# Altium schematic sheet comm.SchDoc
size A4; SheetNumber: 4; SheetTotal: 6
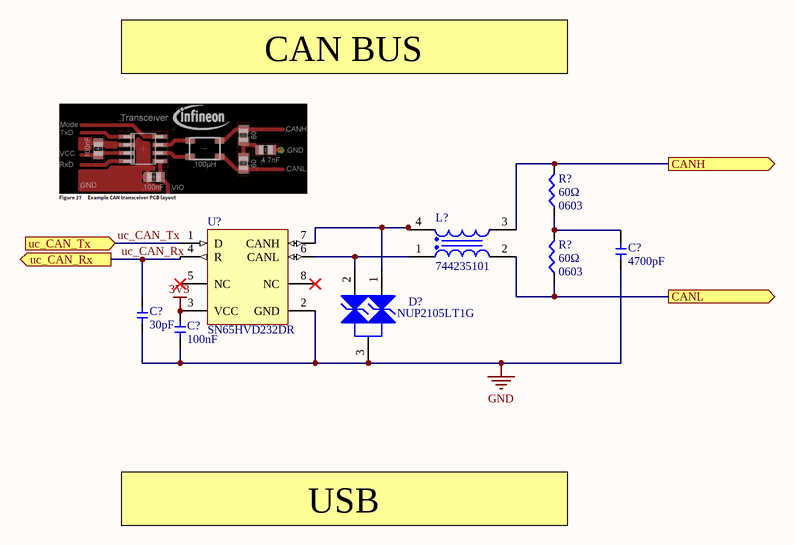
[diagram p0: comm.SchDoc]

## Parts
(Parts that share a designator on the sheet are numbered #1, #2 ... from top to bottom, then left to right.)
C?#1  value 4700pF  [0603_cap]  (hidden comment: 0603_4700pF)
C?#2  value 30pF  [0603_cap]  (hidden comment: 0603_30pF)
C?#3  value 100nF  [0603_cap]  (hidden comment: 0603_100nF)
D?  NUP2105LT1G  [ONSC-SOT-23-3-318-08_V]
L?  744235101  [WE-CNSW_1812]
R?#1  value 60Ω  Package: 0603  [0603-smd]  (hidden comment: 0603_60R)
R?#2  value 60Ω  Package: 0603  [0603-smd]  (hidden comment: 0603_60R)
U?  SN65HVD232DR  [D0008A_M]

## Ports
CANH (out), CANL (out), uc_CAN_Rx (out), uc_CAN_Tx (in)

## Nets
3V3: C?#3.2 U?.3(VCC)
GND: C?#1.1 C?#2.1 C?#3.1 D?.3(K) U?.2(GND)
CANH: L?.3 R?#1.2 ; port CANH
CANL: L?.2 R?#2.1 ; port CANL
uc_CAN_Rx: C?#2.2 U?.4(R) ; port uc_CAN_Rx
uc_CAN_Tx: U?.1(D) ; port uc_CAN_Tx
NetC?#1_2: C?#1.2 R?#1.1 R?#2.2
NetD?_1: D?.1(K) L?.4 U?.7(CANH)
NetD?_2: D?.2(K) L?.1 U?.6(CANL)

Not connected (* = marked no-connect by the designer): U? 5(NC)* 8(NC)*

## Notes on the sheet
- CAN BUS
- USB

## Library data of the parts
C?#1 = 0603_4700pF: Volt: V; Package: 0603
C?#2 = 0603_30pF: Volt: V; Package: 0603
C?#3 = 0603_100nF: Volt: V; Package: 0603
D? = CMP-1063-00164-1: Dual Line CAN Bus Protector, 3-Pin SOT-23, Pb-Free, Tape and Reel; Manufacturer: On Semiconductor; IR Max (uA): 0.1; Number of Lines: 2; Direction: Bidirectional; C Max (pF): 30; PPK Max (W): 350; V(BR) Min (V): 26.2; ComponentLink3URL: http://www.onsemi.cn/pub_link/Collateral/318-08.PDF; Mounting Technology: Surface Mount; ComponentLink2Description: Datasheet; PartNumber: NUP2105LT1G; ComponentLink1URL: http://www.onsemi.com/; PackageVersion: Rev. AP, 11/2009; DatasheetVersion: Rev. 5; RoHS: Pb-Free; PackageReference: SOT-23-3-318-08; ComponentLink2URL: http://www.onsemi.cn/pub_link/Collateral/NUP2105L-D.PDF; ComponentLink1Description: Manufacturer URL; PackageDescription: 3-Pin Small Outline Transistor, Body 2.92 x 1.3 mm, Pitch 0.95 mm; Packing: Tape and Reel; ComponentLink3Description: Package Specification
L? = CMP-207849-000010-2: CMC 100UH 150MA 2LN 8 KOHM SMD; NexarPartId: 61645269; Inductance: 100µH; Number of Lines: 2; DC Resistance (DCR): 2Ω; Voltage Rating (DC): 60V; Test Frequency: 100kHz; Max Current Rating: 150mA; RoHS: Compliant; Packaging: Tape & Reel (TR); Ambient Temperature Range Low: -40°C; Number of Pins: 4; Ambient Temperature Range High: 85°C; Min Operating Temperature: -40°C; Height: 2.8mm; RMS Current (Irms): 150mA; Width: 3.2mm; Current Rating: 150mA; Mount: Surface Mount; Max Operating Temperature: 125°C; Composition: Wirewound; Length: 4.5mm; Series Resistance: 2Ω; Voltage Rating: 60V
R?#1 R?#2 = 0603_60R: Power: W
U? = CMP-0315-00075-2: 3.3 V Can Transceiver, 17 mA, -40 to 85 degC, 8-pin SOIC (D), Green (RoHS & no Sb/Br); Manufacturer: Texas Instruments; Supply Voltage(s)(V): 3.3; Receivers Per Package: 1; ICC(Max)(mA): 17; Rating: Catalog; Transient Pulse Protection(V): -25 to 25; Mounting Technology: Surface Mount; PartNumber: SN65HVD232DR; Code_JEDEC: MS-012AA; Eco-Plan: Green (RoHS & no Sb/Br); Isolated: No; SubFamily: CAN; Footprint: SN65HVD232; Drivers Per Package: 1; ComponentLink1URL: http://www.ti.com/general/docs/lit/getliterature.tsp?genericPartNumber=SN65HVD232&fileType=pdf; ComponentLink1Description: Datasheet; PackageDescription: 8-Pin Plastic Small Outline Integrated Circuit, 4.9 x 3.9 mm, Pitch 1.27 mm Pitch; PackageReference: D0008A; DatasheetVersion: SLOS346K; PackageVersion: revM, Jun-2011